# Altium schematic sheet LED_Board_Schematic.SchDoc
size B; SheetNumber: 1; SheetTotal: 1
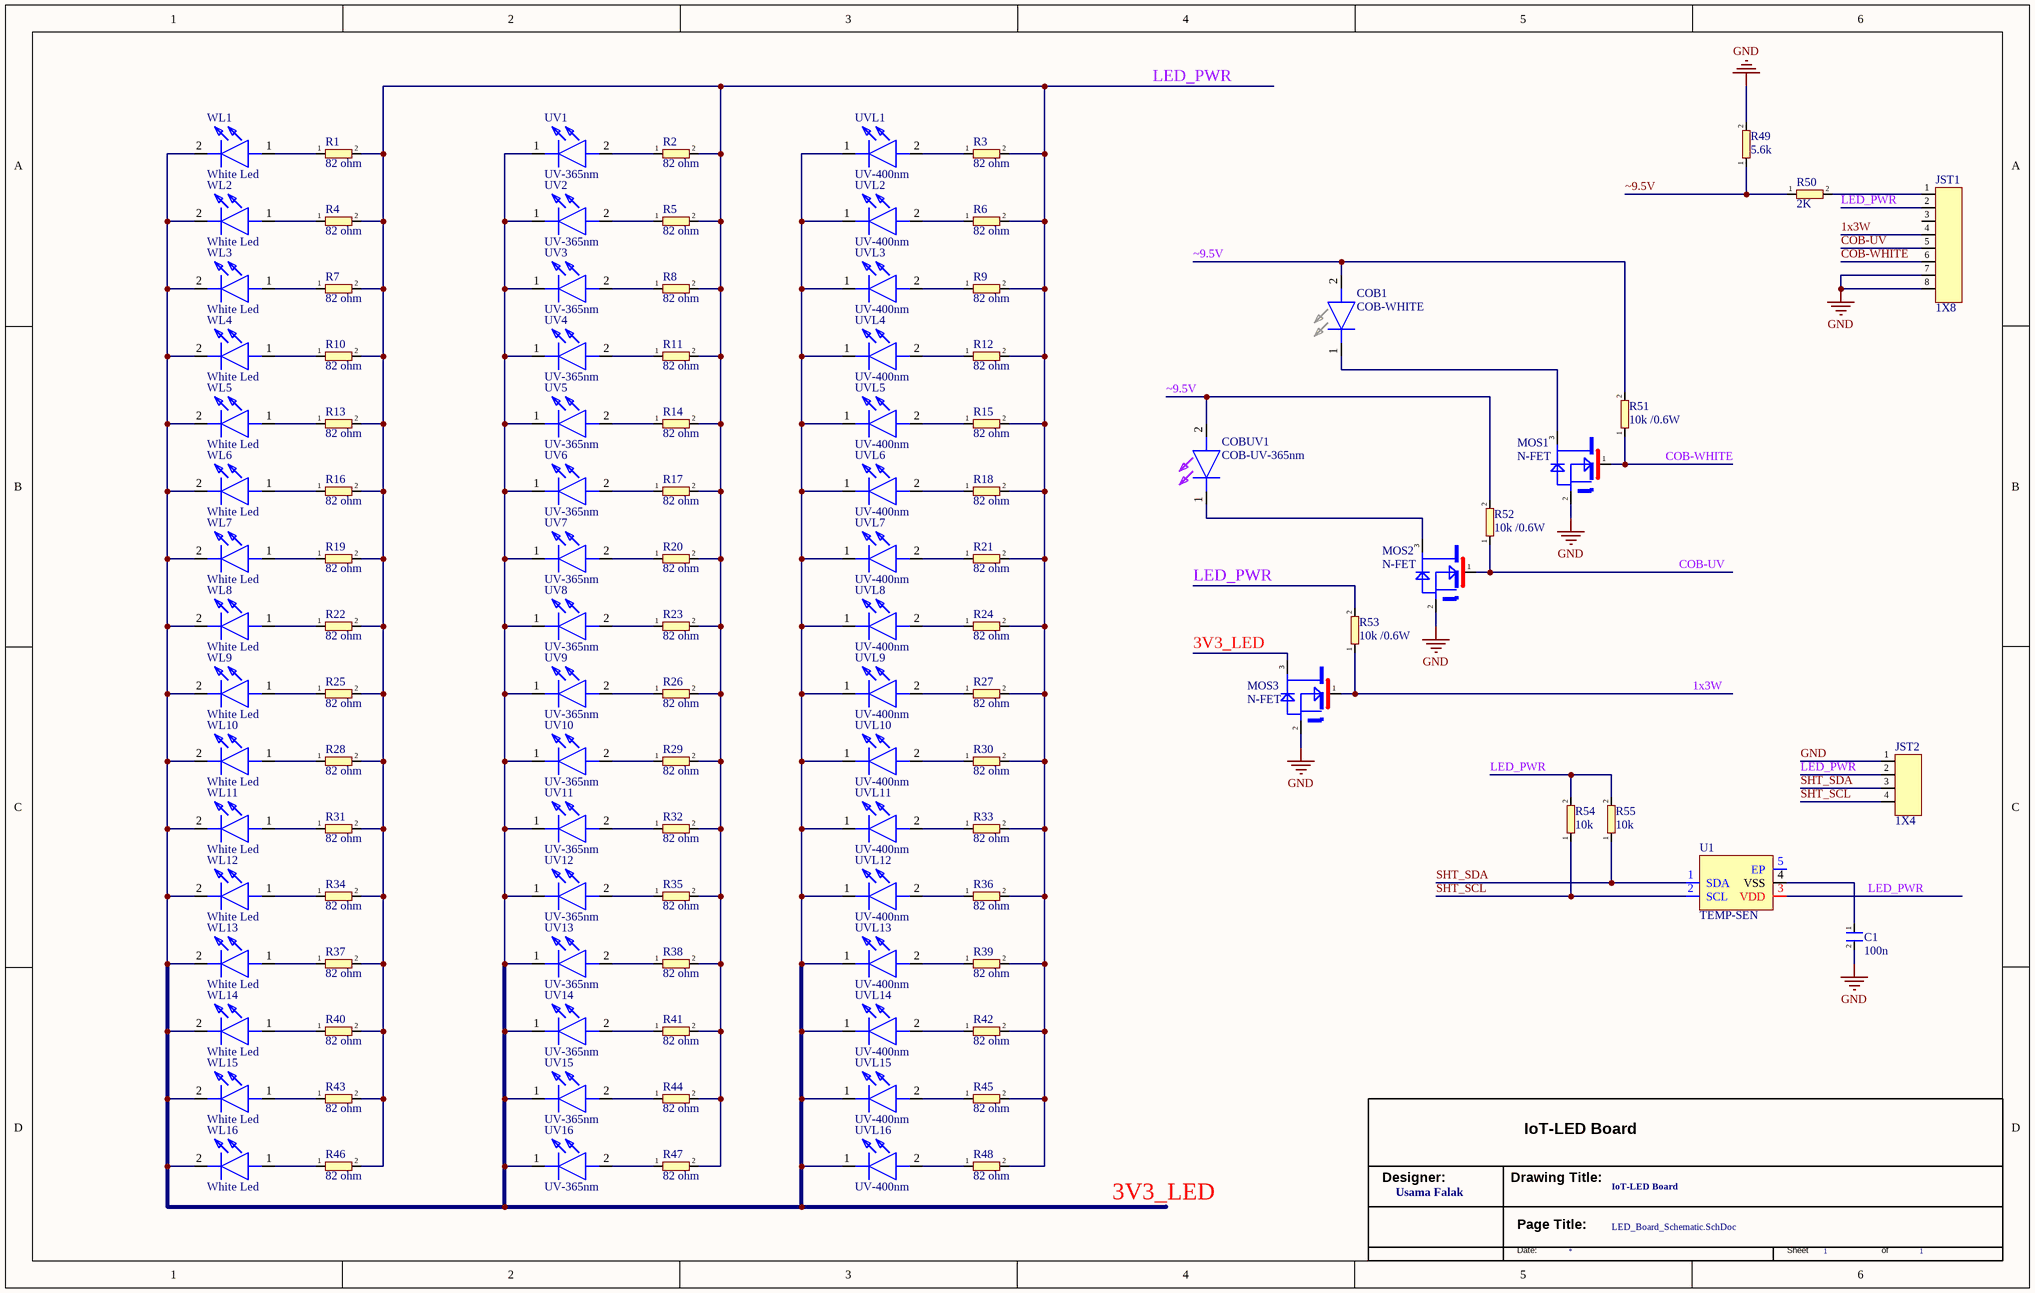
[diagram p0: LED_Board_Schematic.SchDoc]

## Parts
*  TitleBlock_MCPG  (value not drawn)  (graphical)
C1  100n  [SMD-C0603-CAP]
COB1  COB-WHITE  [COB-LED]
COBUV1  COB-UV-365nm  [COB-LED]
JST1  1X8  [JST_1X8_Right Angle]
JST2  1X4  [JST_1X4_Right Angle]
MOS1  N-FET  [SOT-23]
MOS2  N-FET  [SOT-23]
MOS3  N-FET  [SOT-23]
R1  82 ohm  [SMD-1210-RES]
R2  82 ohm  [SMD-1210-RES]
R3  82 ohm  [SMD-1210-RES]
R4  82 ohm  [SMD-1210-RES]
R5  82 ohm  [SMD-1210-RES]
R6  82 ohm  [SMD-1210-RES]
R7  82 ohm  [SMD-1210-RES]
R8  82 ohm  [SMD-1210-RES]
R9  82 ohm  [SMD-1210-RES]
R10  82 ohm  [SMD-1210-RES]
R11  82 ohm  [SMD-1210-RES]
R12  82 ohm  [SMD-1210-RES]
R13  82 ohm  [SMD-1210-RES]
R14  82 ohm  [SMD-1210-RES]
R15  82 ohm  [SMD-1210-RES]
R16  82 ohm  [SMD-1210-RES]
R17  82 ohm  [SMD-1210-RES]
R18  82 ohm  [SMD-1210-RES]
R19  82 ohm  [SMD-1210-RES]
R20  82 ohm  [SMD-1210-RES]
R21  82 ohm  [SMD-1210-RES]
R22  82 ohm  [SMD-1210-RES]
R23  82 ohm  [SMD-1210-RES]
R24  82 ohm  [SMD-1210-RES]
R25  82 ohm  [SMD-1210-RES]
R26  82 ohm  [SMD-1210-RES]
R27  82 ohm  [SMD-1210-RES]
R28  82 ohm  [SMD-1210-RES]
R29  82 ohm  [SMD-1210-RES]
R30  82 ohm  [SMD-1210-RES]
R31  82 ohm  [SMD-1210-RES]
R32  82 ohm  [SMD-1210-RES]
R33  82 ohm  [SMD-1210-RES]
R34  82 ohm  [SMD-1210-RES]
R35  82 ohm  [SMD-1210-RES]
R36  82 ohm  [SMD-1210-RES]
R37  82 ohm  [SMD-1210-RES]
R38  82 ohm  [SMD-1210-RES]
R39  82 ohm  [SMD-1210-RES]
R40  82 ohm  [SMD-1210-RES]
R41  82 ohm  [SMD-1210-RES]
R42  82 ohm  [SMD-1210-RES]
R43  82 ohm  [SMD-1210-RES]
R44  82 ohm  [SMD-1210-RES]
R45  82 ohm  [SMD-1210-RES]
R46  82 ohm  [SMD-1210-RES]
R47  82 ohm  [SMD-1210-RES]
R48  82 ohm  [SMD-1210-RES]
R49  5.6k  [SMD-2010-RES]
R50  2K  [SMD-2010-RES]
R51  10k /0.6W  [SMD-1210-RES]
R52  10k /0.6W  [SMD-1210-RES]
R53  10k /0.6W  [SMD-1210-RES]
R54  10k  [SMD-0603-RES]
R55  10k  [SMD-0603-RES]
U1  TEMP-SEN  [SHT-41-TEMP-SENSOR]
UV1  UV-365nm  [SMD-2835-UV365NM]
UV2  UV-365nm  [SMD-2835-UV365NM]
UV3  UV-365nm  [SMD-2835-UV365NM]
UV4  UV-365nm  [SMD-2835-UV365NM]
UV5  UV-365nm  [SMD-2835-UV365NM]
UV6  UV-365nm  [SMD-2835-UV365NM]
UV7  UV-365nm  [SMD-2835-UV365NM]
UV8  UV-365nm  [SMD-2835-UV365NM]
UV9  UV-365nm  [SMD-2835-UV365NM]
UV10  UV-365nm  [SMD-2835-UV365NM]
UV11  UV-365nm  [SMD-2835-UV365NM]
UV12  UV-365nm  [SMD-2835-UV365NM]
UV13  UV-365nm  [SMD-2835-UV365NM]
UV14  UV-365nm  [SMD-2835-UV365NM]
UV15  UV-365nm  [SMD-2835-UV365NM]
UV16  UV-365nm  [SMD-2835-UV365NM]
UVL1  UV-400nm  [SMD-2835-UV400NM]
UVL2  UV-400nm  [SMD-2835-UV400NM]
UVL3  UV-400nm  [SMD-2835-UV400NM]
UVL4  UV-400nm  [SMD-2835-UV400NM]
UVL5  UV-400nm  [SMD-2835-UV400NM]
UVL6  UV-400nm  [SMD-2835-UV400NM]
UVL7  UV-400nm  [SMD-2835-UV400NM]
UVL8  UV-400nm  [SMD-2835-UV400NM]
UVL9  UV-400nm  [SMD-2835-UV400NM]
UVL10  UV-400nm  [SMD-2835-UV400NM]
UVL11  UV-400nm  [SMD-2835-UV400NM]
UVL12  UV-400nm  [SMD-2835-UV400NM]
UVL13  UV-400nm  [SMD-2835-UV400NM]
UVL14  UV-400nm  [SMD-2835-UV400NM]
UVL15  UV-400nm  [SMD-2835-UV400NM]
UVL16  UV-400nm  [SMD-2835-UV400NM]
WL1  White Led  [SMD-2835-WHITE]
WL2  White Led  [SMD-2835-WHITE]
WL3  White Led  [SMD-2835-WHITE]
WL4  White Led  [SMD-2835-WHITE]
WL5  White Led  [SMD-2835-WHITE]
WL6  White Led  [SMD-2835-WHITE]
WL7  White Led  [SMD-2835-WHITE]
WL8  White Led  [SMD-2835-WHITE]
WL9  White Led  [SMD-2835-WHITE]
WL10  White Led  [SMD-2835-WHITE]
WL11  White Led  [SMD-2835-WHITE]
WL12  White Led  [SMD-2835-WHITE]
WL13  White Led  [SMD-2835-WHITE]
WL14  White Led  [SMD-2835-WHITE]
WL15  White Led  [SMD-2835-WHITE]
WL16  White Led  [SMD-2835-WHITE]

## Nets
GND: C1.2 JST1.7 JST1.8 JST2.1 MOS1.2 MOS2.2 MOS3.2 R49.2
1x3W: JST1.4 MOS3.1(G) R53.1
3V3_LED: MOS3.3 UV1.1(K) UV2.1(K) UV3.1(K) UV4.1(K) UV5.1(K) UV6.1(K) UV7.1(K) UV8.1(K) UV9.1(K) UV10.1(K) UV11.1(K) UV12.1(K) UV13.1(K) UV14.1(K) UV15.1(K) UV16.1(K) UVL1.1(K) UVL2.1(K) UVL3.1(K) UVL4.1(K) UVL5.1(K) UVL6.1(K) UVL7.1(K) UVL8.1(K) UVL9.1(K) UVL10.1(K) UVL11.1(K) UVL12.1(K) UVL13.1(K) UVL14.1(K) UVL15.1(K) UVL16.1(K) WL1.2(K) WL2.2(K) WL3.2(K) WL4.2(K) WL5.2(K) WL6.2(K) WL7.2(K) WL8.2(K) WL9.2(K) WL10.2(K) WL11.2(K) WL12.2(K) WL13.2(K) WL14.2(K) WL15.2(K) WL16.2(K)
COB-UV: JST1.5 MOS2.1(G) R52.1
COB-WHITE: JST1.6 MOS1.1(G) R51.1
LED_PWR: JST1.2 JST2.2 R1.2 R2.2 R3.2 R4.2 R5.2 R6.2 R7.2 R8.2 R9.2 R10.2 R11.2 R12.2 R13.2 R14.2 R15.2 R16.2 R17.2 R18.2 R19.2 R20.2 R21.2 R22.2 R23.2 R24.2 R25.2 R26.2 R27.2 R28.2 R29.2 R30.2 R31.2 R32.2 R33.2 R34.2 R35.2 R36.2 R37.2 R38.2 R39.2 R40.2 R41.2 R42.2 R43.2 R44.2 R45.2 R46.2 R47.2 R48.2 R53.2 R54.2 R55.2 U1.3(VDD)
SHT_SCL: JST2.4 R54.1 U1.2(SCL)
SHT_SDA: JST2.3 R55.1 U1.1(SDA)
~9.5V: COB1.2(A) COBUV1.2(A) R49.1 R50.1 R51.2 R52.2
NetC1_1: C1.1 U1.4(VSS)
NetCOB1_1: COB1.1(K) MOS1.3
NetCOBUV1_1: COBUV1.1(K) MOS2.3
NetJST1_1: JST1.1 R50.2
NetR1_1: R1.1 WL1.1(A)
NetR2_1: R2.1 UV1.2(A)
NetR3_1: R3.1 UVL1.2(A)
NetR4_1: R4.1 WL2.1(A)
NetR5_1: R5.1 UV2.2(A)
NetR6_1: R6.1 UVL2.2(A)
NetR7_1: R7.1 WL3.1(A)
NetR8_1: R8.1 UV3.2(A)
NetR9_1: R9.1 UVL3.2(A)
NetR10_1: R10.1 WL4.1(A)
NetR11_1: R11.1 UV4.2(A)
NetR12_1: R12.1 UVL4.2(A)
NetR13_1: R13.1 WL5.1(A)
NetR14_1: R14.1 UV5.2(A)
NetR15_1: R15.1 UVL5.2(A)
NetR16_1: R16.1 WL6.1(A)
NetR17_1: R17.1 UV6.2(A)
NetR18_1: R18.1 UVL6.2(A)
NetR19_1: R19.1 WL7.1(A)
NetR20_1: R20.1 UV7.2(A)
NetR21_1: R21.1 UVL7.2(A)
NetR22_1: R22.1 WL8.1(A)
NetR23_1: R23.1 UV8.2(A)
NetR24_1: R24.1 UVL8.2(A)
NetR25_1: R25.1 WL9.1(A)
NetR26_1: R26.1 UV9.2(A)
NetR27_1: R27.1 UVL9.2(A)
NetR28_1: R28.1 WL10.1(A)
NetR29_1: R29.1 UV10.2(A)
NetR30_1: R30.1 UVL10.2(A)
NetR31_1: R31.1 WL11.1(A)
NetR32_1: R32.1 UV11.2(A)
NetR33_1: R33.1 UVL11.2(A)
NetR34_1: R34.1 WL12.1(A)
NetR35_1: R35.1 UV12.2(A)
NetR36_1: R36.1 UVL12.2(A)
NetR37_1: R37.1 WL13.1(A)
NetR38_1: R38.1 UV13.2(A)
NetR39_1: R39.1 UVL13.2(A)
NetR40_1: R40.1 WL14.1(A)
NetR41_1: R41.1 UV14.2(A)
NetR42_1: R42.1 UVL14.2(A)
NetR43_1: R43.1 WL15.1(A)
NetR44_1: R44.1 UV15.2(A)
NetR45_1: R45.1 UVL15.2(A)
NetR46_1: R46.1 WL16.1(A)
NetR47_1: R47.1 UV16.2(A)
NetR48_1: R48.1 UVL16.2(A)

Not connected (* = marked no-connect by the designer): JST1 3; U1 5(EP)

## Notes on the sheet
- (in symbol TitleBlock_MCPG) IoT-LED Board; Designer:; Drawing Title:; Usama Falak; Page Title:; Date:; Sheet; of

## Library data of the parts
C1 = SMD CAP 100n: 50V 100nF X7R ±10% 0603 Multilayer Ceramic Capacitors MLCC - SMD/SMT ROHS; Manufacturer-Part#: C0603B104K500NT; Size: C0603; LCSC-Part#: C478888; ComponentLink1Description: LCSC-Link; ComponentLink1URL: https://www.lcsc.com/product-detail/Multilayer-Ceramic-Capacitors-MLCC-SMD-SMT_TORCH-C0603B104K500NT_C478888.html; ComponentLink2Description: Datasheet-Link; ComponentLink2URL: https://www.lcsc.com/datasheet/lcsc_datasheet_2410121438_TORCH-C0603B104K500NT_C478888.pdf
COB1 = COB-WHITE: CHANZON High Power Led Chip 10W White (6000K - 6500K / 900mA / DC 9V - 11V / 10 Watt) Super Bright Intensity SMD COB Light Emitter Components Diode 10 W Bulb Lamp Beads DIY Lighting; Manufacturer-Part#: ‎1DGL-JC-10W-WH; ComponentLink1Description: Link; ComponentLink1URL: https://www.amazon.com/dp/B01DBZJY4S?ref=cm_sw_r_cso_cp_apin_dp_G1DYNRDFE0ZMXRZ1Z5GE_1&ref_=cm_sw_r_cso_cp_apin_dp_G1DYNRDFE0ZMXRZ1Z5GE_1&social_share=cm_sw_r_cso_cp_apin_dp_G1DYNRDFE0ZMXRZ1Z5GE_1&th=1; Size: NONE; ComponentLink2Description: Datasheet-Link; ComponentLink2URL: NONE; LCSC-Part#: NONE
COBUV1 = COB-365nm: 10W COB Module High Power LED Chip 365nm UV Multifunctional Blacklight Super Bright Lighting Emitter for DIY Lighting Fixtures(1050mA/ultraviolet 365nm-370nm/10Watt/ DC 10V-11V); Manufacturer-Part#: ‎JH-10V14G45-R1C-370; ComponentLink1Description: Link; ComponentLink1URL: https://www.amazon.com/dp/B0CM3865QB?ref=cm_sw_r_cso_cp_apin_dp_9AV76P7C8ZZW5QCZKSMR&ref_=cm_sw_r_cso_cp_apin_dp_9AV76P7C8ZZW5QCZKSMR&social_share=cm_sw_r_cso_cp_apin_dp_9AV76P7C8ZZW5QCZKSMR&th=1; Size: NONE; ComponentLink2Description: Datasheet-Link; ComponentLink2URL: NONE; LCSC-Part#: NONE
JST1 = JST 1x8_Right Angle: 1x8P 8P PA Tin 8 -25℃~+85℃ 3A 1 2mm Copper alloy Right-Angle Push-Pull,P=2mm Wire To Board Connector ROHS; Manufacturer-Part#: S08B-PASK-2(LF)(SN); Size: 1x8P; LCSC-Part#: C495701; ComponentLink1Description: LCSC-Link; ComponentLink1URL: https://www.lcsc.com/product-detail/Wire-To-Board-Connector_JST-S08B-PASK-2-LF-SN_C495701.html; ComponentLink2Description: Datasheet-Link; ComponentLink2URL: https://www.lcsc.com/datasheet/lcsc_datasheet_2410010232_JST-S08B-PASK-2-LF-SN_C495701.pdf
JST2 = JST 1x4_Right Angle: 1x4P 4P EH Tin 4 -25℃~+85℃ 3A 1 2.5mm Brass Right-Angle Push-Pull,P=2.5mm Wire To Board Connector ROHS; Manufacturer-Part#: S4B-EH(LF)(SN); Size: 1x4P; LCSC-Part#: C265068; ComponentLink1Description: LCSC-Link; ComponentLink1URL: https://www.lcsc.com/product-detail/Wire-To-Board-Connector_JST-S4B-EH-LF-SN_C265068.html; ComponentLink2Description: Datasheet-Link; ComponentLink2URL: https://www.lcsc.com/datasheet/lcsc_datasheet_2304140030_JST-S4B-EH-LF-SN_C265068.pdf
MOS1-MOS3 = N-Channel-MOSFET: 20V 6.3A 1.3W 21mΩ@4.5V,6.3A 1.1V 1 N-channel SOT-23 MOSFETs ROHS; Manufacturer-Part#: IRLML6244; Size: SOT-23; LCSC-Part#: C5364311; ComponentLink1Description: LCSC-Link; ComponentLink1URL: https://www.lcsc.com/product-detail/MOSFETs_Guangdong-Hottech-IRLML6244_C5364311.html?s_z=n_IRLML62; ComponentLink2Description: Datasheet-Link; ComponentLink2URL: https://www.lcsc.com/datasheet/lcsc_datasheet_2410121947_Guangdong-Hottech-IRLML6244_C5364311.pdf
R1-R48 = SMD Resistor 82: 500mW Thick Film Resistors 200V ±100ppm/℃ ±1% 82Ω 1210 Chip Resistor - Surface Mount ROHS; Manufacturer-Part#: AC1210FR-0782RL; Size: R1210; LCSC-Part#: C230357; ComponentLink1Description: LCSC-Link; ComponentLink1URL: https://www.lcsc.com/product-detail/Chip-Resistor-Surface-Mount_YAGEO-AC1210FR-0782RL_C230357.html?s_z=n_Resistor; ComponentLink2Description: Datasheet-Link; ComponentLink2URL: https://www.lcsc.com/datasheet/lcsc_datasheet_2304140030_YAGEO-AC1210FR-0782RL_C230357.pdf
R49 = SMD Resistor 5.6k: 0.75W Thick Film Resistors 200V ±100ppm/℃ ±1% 5.6kΩ 2010 Chip Resistor - Surface Mount ROHS; Manufacturer-Part#: 201007F5601T4E; Size: R2010; LCSC-Part#: C407021; ComponentLink1Description: LCSC-Link; ComponentLink1URL: https://www.lcsc.com/product-detail/Chip-Resistor-Surface-Mount_UNI-ROYAL-Uniroyal-Elec-201007F5601T4E_C407021.html; ComponentLink2Description: Datasheet-Link; ComponentLink2URL: https://www.lcsc.com/datasheet/lcsc_datasheet_2411221126_UNI-ROYAL-Uniroyal-Elec-201007F5601T4E_C407021.pdf
R50 = SMD Resistor 2K: 0.75W Thick Film Resistors 200V ±100ppm/℃ ±1% 2kΩ 2010 Chip Resistor - Surface Mount ROHS; Manufacturer-Part#: 201007F2001T4E; Size: R2010; LCSC-Part#: C421898; ComponentLink1Description: LCSC-Link; ComponentLink1URL: https://www.lcsc.com/product-detail/Chip-Resistor-Surface-Mount_UNI-ROYAL-Uniroyal-Elec-201007F2001T4E_C421898.html; ComponentLink2Description: Datasheet-Link; ComponentLink2URL: https://www.lcsc.com/datasheet/lcsc_datasheet_2411221126_UNI-ROYAL-Uniroyal-Elec-201007F2001T4E_C421898.pdf
R51-R53 = SMD Resistor 10K-1210: 0.6W Thick Film Resistors 200V ±100ppm/℃ ±5% 2.2MΩ 1206 Chip Resistor - Surface Mount ROHS; Manufacturer-Part#: AS0606J0225T5E; Size: R1210; LCSC-Part#: C966067; ComponentLink1Description: LCSC-Link; ComponentLink1URL: https://www.lcsc.com/product-detail/Chip-Resistor-Surface-Mount_UNI-ROYAL-Uniroyal-Elec-AS0606J0225T5E_C966067.html; ComponentLink2Description: Datasheet-Link; ComponentLink2URL: https://www.lcsc.com/datasheet/lcsc_datasheet_2409272232_UNI-ROYAL-Uniroyal-Elec-AS0606J0225T5E_C966067.pdf
R54 R55 = SMD Resistor 10k: 0.1W Thin Film Resistor 75V ±0.1% ±25ppm/℃ 10kΩ 0603 Chip Resistor - Surface Mount ROHS; Manufacturer-Part#: ERA3AEB103V; Size: R0603; LCSC-Part#: C190610; ComponentLink1Description: LCSC-Link; ComponentLink1URL: https://www.lcsc.com/product-detail/Chip-Resistor-Surface-Mount_PANASONIC-ERA3AEB103V_C190610.html; ComponentLink2Description: Datasheet-Link; ComponentLink2URL: https://www.lcsc.com/datasheet/lcsc_datasheet_1810010251_PANASONIC-ERA3AEB103V_C190610.pdf
U1 = SHT-41: Manufacturer-Part#: SHT41-AD1F-R2; Size: C0603; LCSC-Part#: C7461862
UV1-UV16 = UV365nm: 3200mcd Colorless Transparent Lens -40℃~+100℃ 360nm~370nm Purple 30° 3V~3.6V SMD2835 LED Indication - Discrete ROHS; Manufacturer-Part#: JNJ-LTHU0106W30/Q15mil/365-370NM; ComponentLink1Description: LCSC-Link; ComponentLink1URL: https://www.lcsc.com/product-detail/LED-Indication-Discrete_JNJ-OPTOELECTRONICS-JNJ-LTHU0106W30-Q15mil-365-370NM_C7500131.html?s_z=n_LED; Size: SMD-2835; ComponentLink2Description: Datasheet-Link; ComponentLink2URL: https://www.lcsc.com/datasheet/lcsc_datasheet_2410121451_JNJ-OPTOELECTRONICS-JNJ-LTHU0106W30-Q15mil-365-370NM_C7500131.pdf; LCSC-Part#: C7500131
UVL1-UVL16 = UV400nm: 150mA Colorless Transparent Lens -40℃~+100℃ 400nm~410nm Purple 60° 3V~3.6V SMD2835 LED Indication - Discrete ROHS; Manufacturer-Part#: JNJ-LTHU0108W60/Q20mil/400-405NM; ComponentLink1Description: LCSC-Link; ComponentLink1URL: https://www.lcsc.com/product-detail/LED-Indication-Discrete_JNJ-OPTOELECTRONICS-JNJ-LTHU0108W60-Q20mil-400-405NM_C7500135.html?s_z=n_LED; Size: SMD-2835; ComponentLink2Description: Datasheet-Link; ComponentLink2URL: https://www.lcsc.com/datasheet/lcsc_datasheet_2410121451_JNJ-OPTOELECTRONICS-JNJ-LTHU0108W60-Q20mil-400-405NM_C7500135.pdf; LCSC-Part#: C7500135
WL1-WL16 = White: 150mA 5500K~6500K 48000mcd -40℃~+100℃ White 60° 3V~3.6V SMD2835 LED Indication - Discrete ROHS; Manufacturer-Part#: JNJ-LTJH0102W60/9x26mil/5500-6500K; ComponentLink1Description: LCSC-Link; ComponentLink1URL: https://www.lcsc.com/product-detail/LED-Indication-Discrete_JNJ-OPTOELECTRONICS-JNJ-LTJH0102W60-9x26mil-5500-6500K_C7500119.html?s_z=n_LED; Size: SMD-2835; ComponentLink2Description: Datasheet-Link; ComponentLink2URL: https://www.lcsc.com/datasheet/lcsc_datasheet_2410121451_JNJ-OPTOELECTRONICS-JNJ-LTJH0102W60-9x26mil-5500-6500K_C7500119.pdf; LCSC-Part#: C7500119
* = TitleBlock_MCPG: Page Create Date: March  8, 1995